# EasyEDA Pro project Esquemático e Layout - BitControl.eprj

# Schematic Schematic1
Board Name: Board1; Create Date: 2025-08-24; Page Name: P1; Project Name: New Project_Version_2; Schematic Name: Schematic1; Update Date: 2025-08-31; Company: EasyEDA.com; Page Size: A4; Version: V1.0
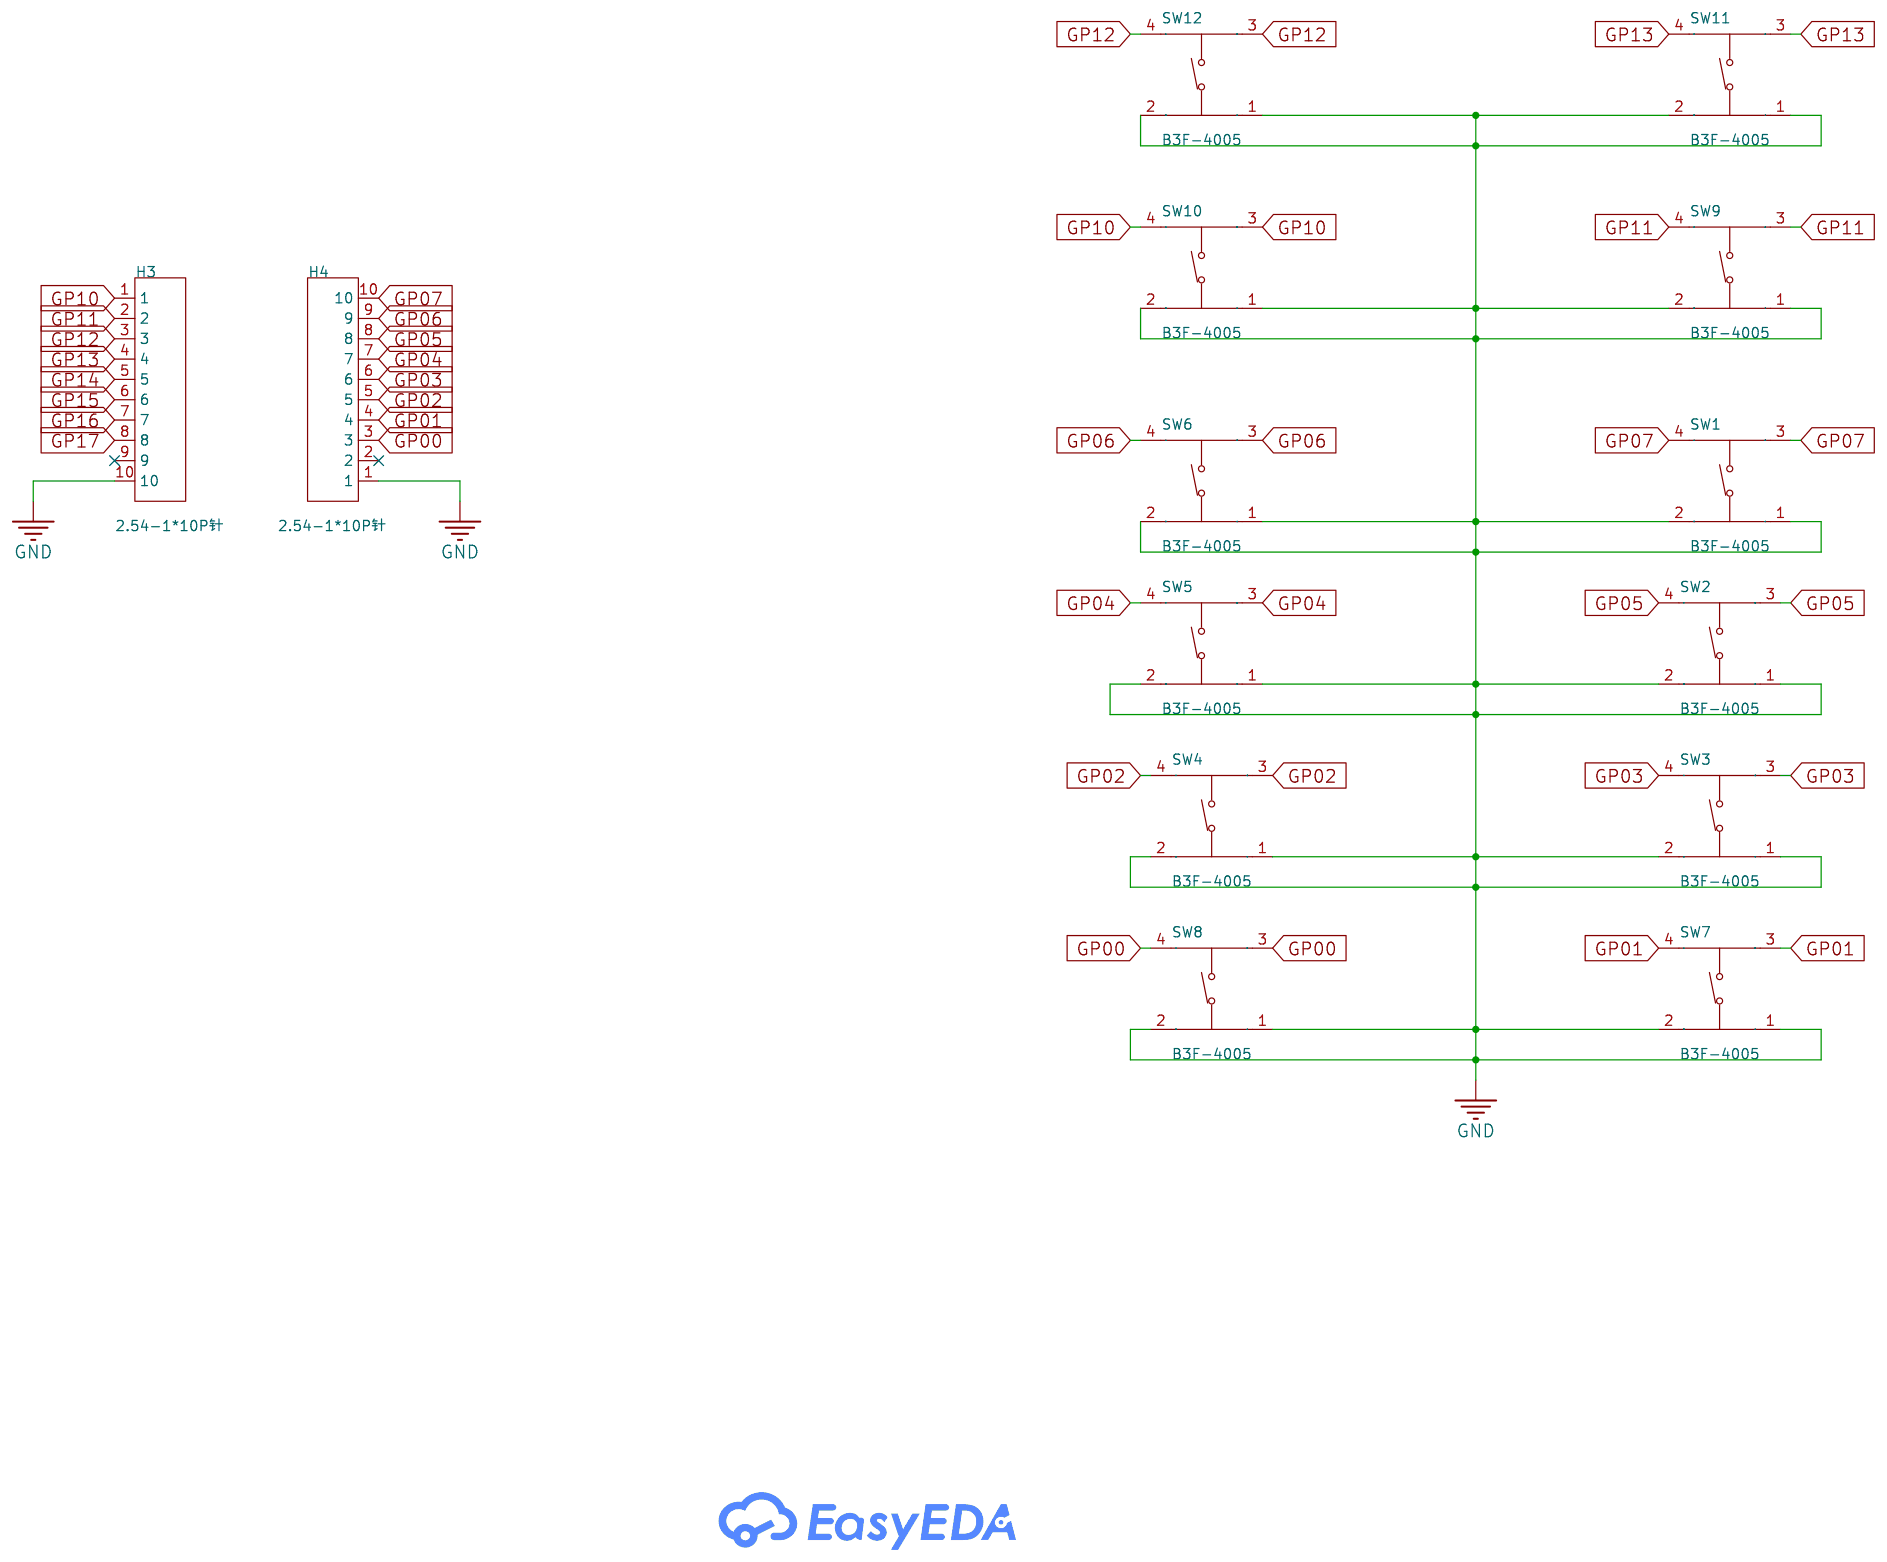
[diagram p0: schematic sheet]

## Parts
H3  2.54-1*10P针  [HDR-TH_10P-P2.54-V-M-1]
H4  2.54-1*10P针  [HDR-TH_10P-P2.54-V-M-1]
SW1  B3F-4005  [SW-TH_4P-L12.0-W12.0-P5.00-LS12.5-EH]
SW2  B3F-4005  [SW-TH_4P-L12.0-W12.0-P5.00-LS12.5-EH]
SW3  B3F-4005  [SW-TH_4P-L12.0-W12.0-P5.00-LS12.5-EH]
SW4  B3F-4005  [SW-TH_4P-L12.0-W12.0-P5.00-LS12.5-EH]
SW5  B3F-4005  [SW-TH_4P-L12.0-W12.0-P5.00-LS12.5-EH]
SW6  B3F-4005  [SW-TH_4P-L12.0-W12.0-P5.00-LS12.5-EH]
SW7  B3F-4005  [SW-TH_4P-L12.0-W12.0-P5.00-LS12.5-EH]
SW8  B3F-4005  [SW-TH_4P-L12.0-W12.0-P5.00-LS12.5-EH]
SW9  B3F-4005  [SW-TH_4P-L12.0-W12.0-P5.00-LS12.5-EH]
SW10  B3F-4005  [SW-TH_4P-L12.0-W12.0-P5.00-LS12.5-EH]
SW11  B3F-4005  [SW-TH_4P-L12.0-W12.0-P5.00-LS12.5-EH]
SW12  B3F-4005  [SW-TH_4P-L12.0-W12.0-P5.00-LS12.5-EH]

## Library data of the parts
H3 H4 = 2.54-1*10P针: Pin Structure:1x10P Pitch:2.54mm Row Spacing:- Circluar Pins/Square Pins:Policy Mounting Type:Straight Number of Rows:Single Row Number of Pins:10P Current Rating:3A Voltage Rating (Max):- Length of Mating Pin:- Insulation Height:- Length of End Connectio; LCSC Part Name: 1x10P 间距:2.54mm 方针 直插; Supplier Part: C57369; Manufacturer: BOOMELE(博穆精密); Supplier Footprint: 插件,P=2.54mm; JLCPCB Part Class: Extended Part; Datasheet: https://atta.szlcsc.com/upload/public/pdf/source/20151109/1457707572883.pdf; Supplier: LCSC; Pin Structure: 1x10P; Pitch: 2.54mm; Circluar Pins/Square Pins: Policy; Mounting Type: Straight; Number of Rows: Single Row; Number of Pins: 10P; Current Rating: 3A; Operating Temperature: -40℃~+105℃; Color: Black
SW1-SW12 = B3F-4005_C397283: Circuit:SPST Actuator Style:Round Button Mounting Style:Direct Insert Switch Length:12mm Switch Width:12mm Switch Height:4.3mm With Lamp:- Mechanical Life:-; LCSC Part Name: 12*12*4.3mm 直插 轻触开关; Supplier Part: C397283; Manufacturer: OMRON(欧姆龙); Supplier Footprint: 插件,12x12mm; JLCPCB Part Class: Extended Part; Datasheet: https://atta.szlcsc.com/upload/public/pdf/source/20191212/C469135_90BE0DB612FA51D178D2ECFD00DF8DE6.pdf; Supplier: LCSC; Circuit: SPST; Actuator Style: Round Button; Mounting Style: Direct Insert; Switch Length: 12mm; Switch Width: 12mm; Switch Height: 4.3mm

## Nets
GND: H3.10 H4.1 SW1.1 SW1.2 SW2.1 SW2.2 SW3.1 SW3.2 SW4.1 SW4.2 SW5.1 SW5.2 SW6.1 SW6.2 SW7.1 SW7.2 SW8.1 SW8.2 SW9.1 SW9.2 SW10.1 SW10.2 SW11.1 SW11.2 SW12.1 SW12.2
GP00: H4.3 SW8.3 SW8.4
GP01: H4.4 SW7.3 SW7.4
GP02: H4.5 SW4.3 SW4.4
GP03: H4.6 SW3.3 SW3.4
GP04: H4.7 SW5.3 SW5.4
GP05: H4.8 SW2.3 SW2.4
GP06: H4.9 SW6.3 SW6.4
GP07: H4.10 SW1.3 SW1.4
GP10: H3.1 SW10.3 SW10.4
GP11: H3.2 SW9.3 SW9.4
GP12: H3.3 SW12.3 SW12.4
GP13: H3.4 SW11.3 SW11.4
GP14: H3.5
GP15: H3.6
GP16: H3.7
GP17: H3.8

Not connected (* = marked no-connect by the designer): H3 9*; H4 2*

# Board PCB1
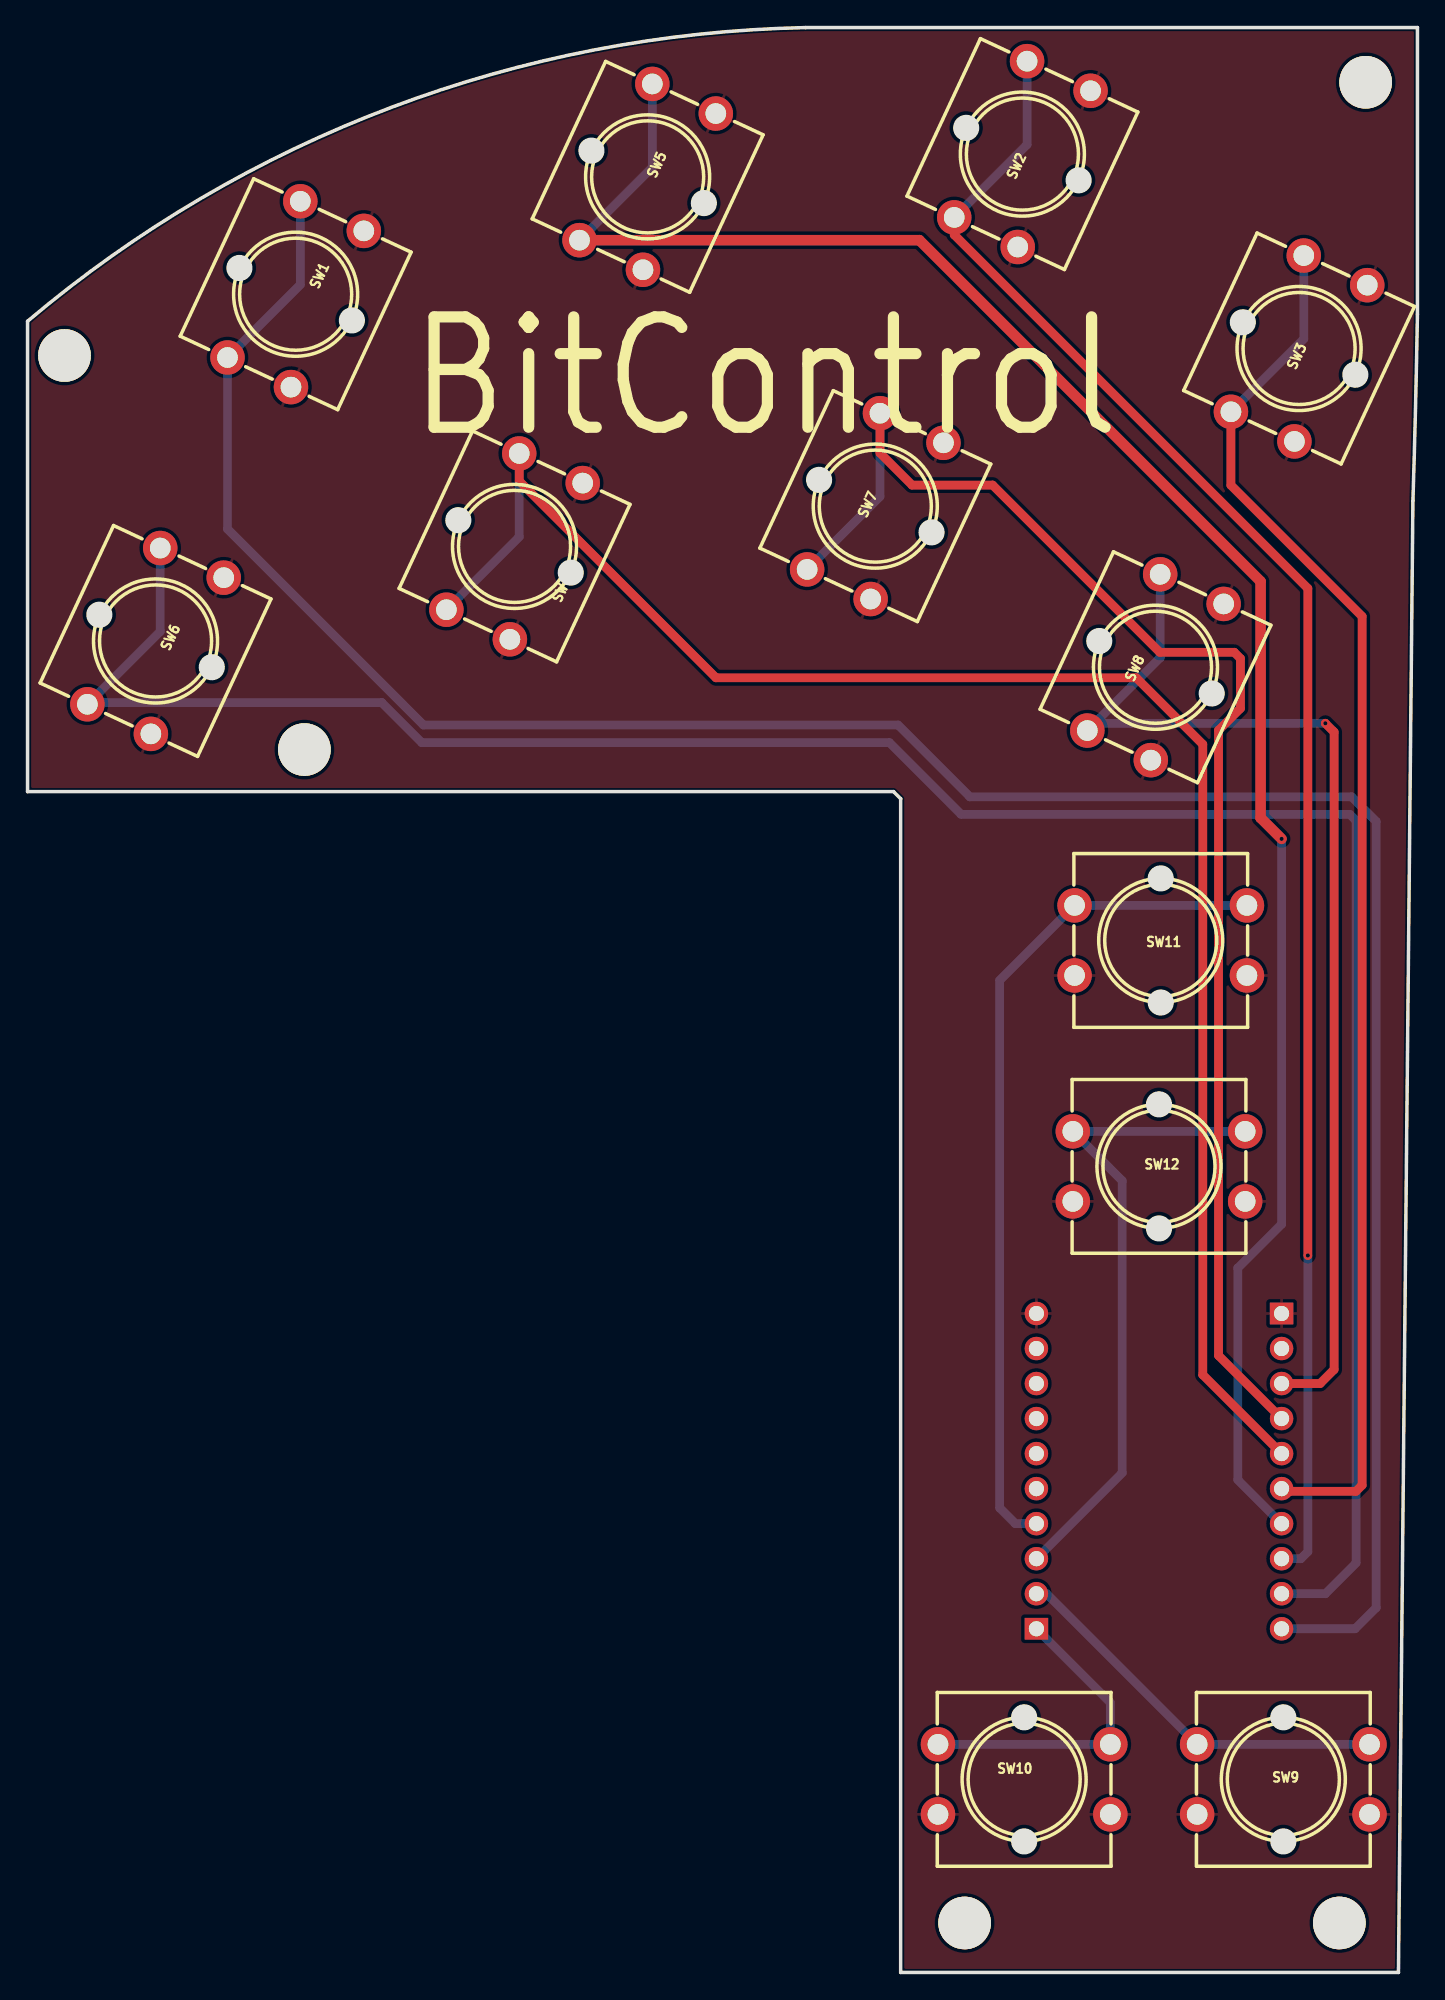
[diagram p1: board, top side]
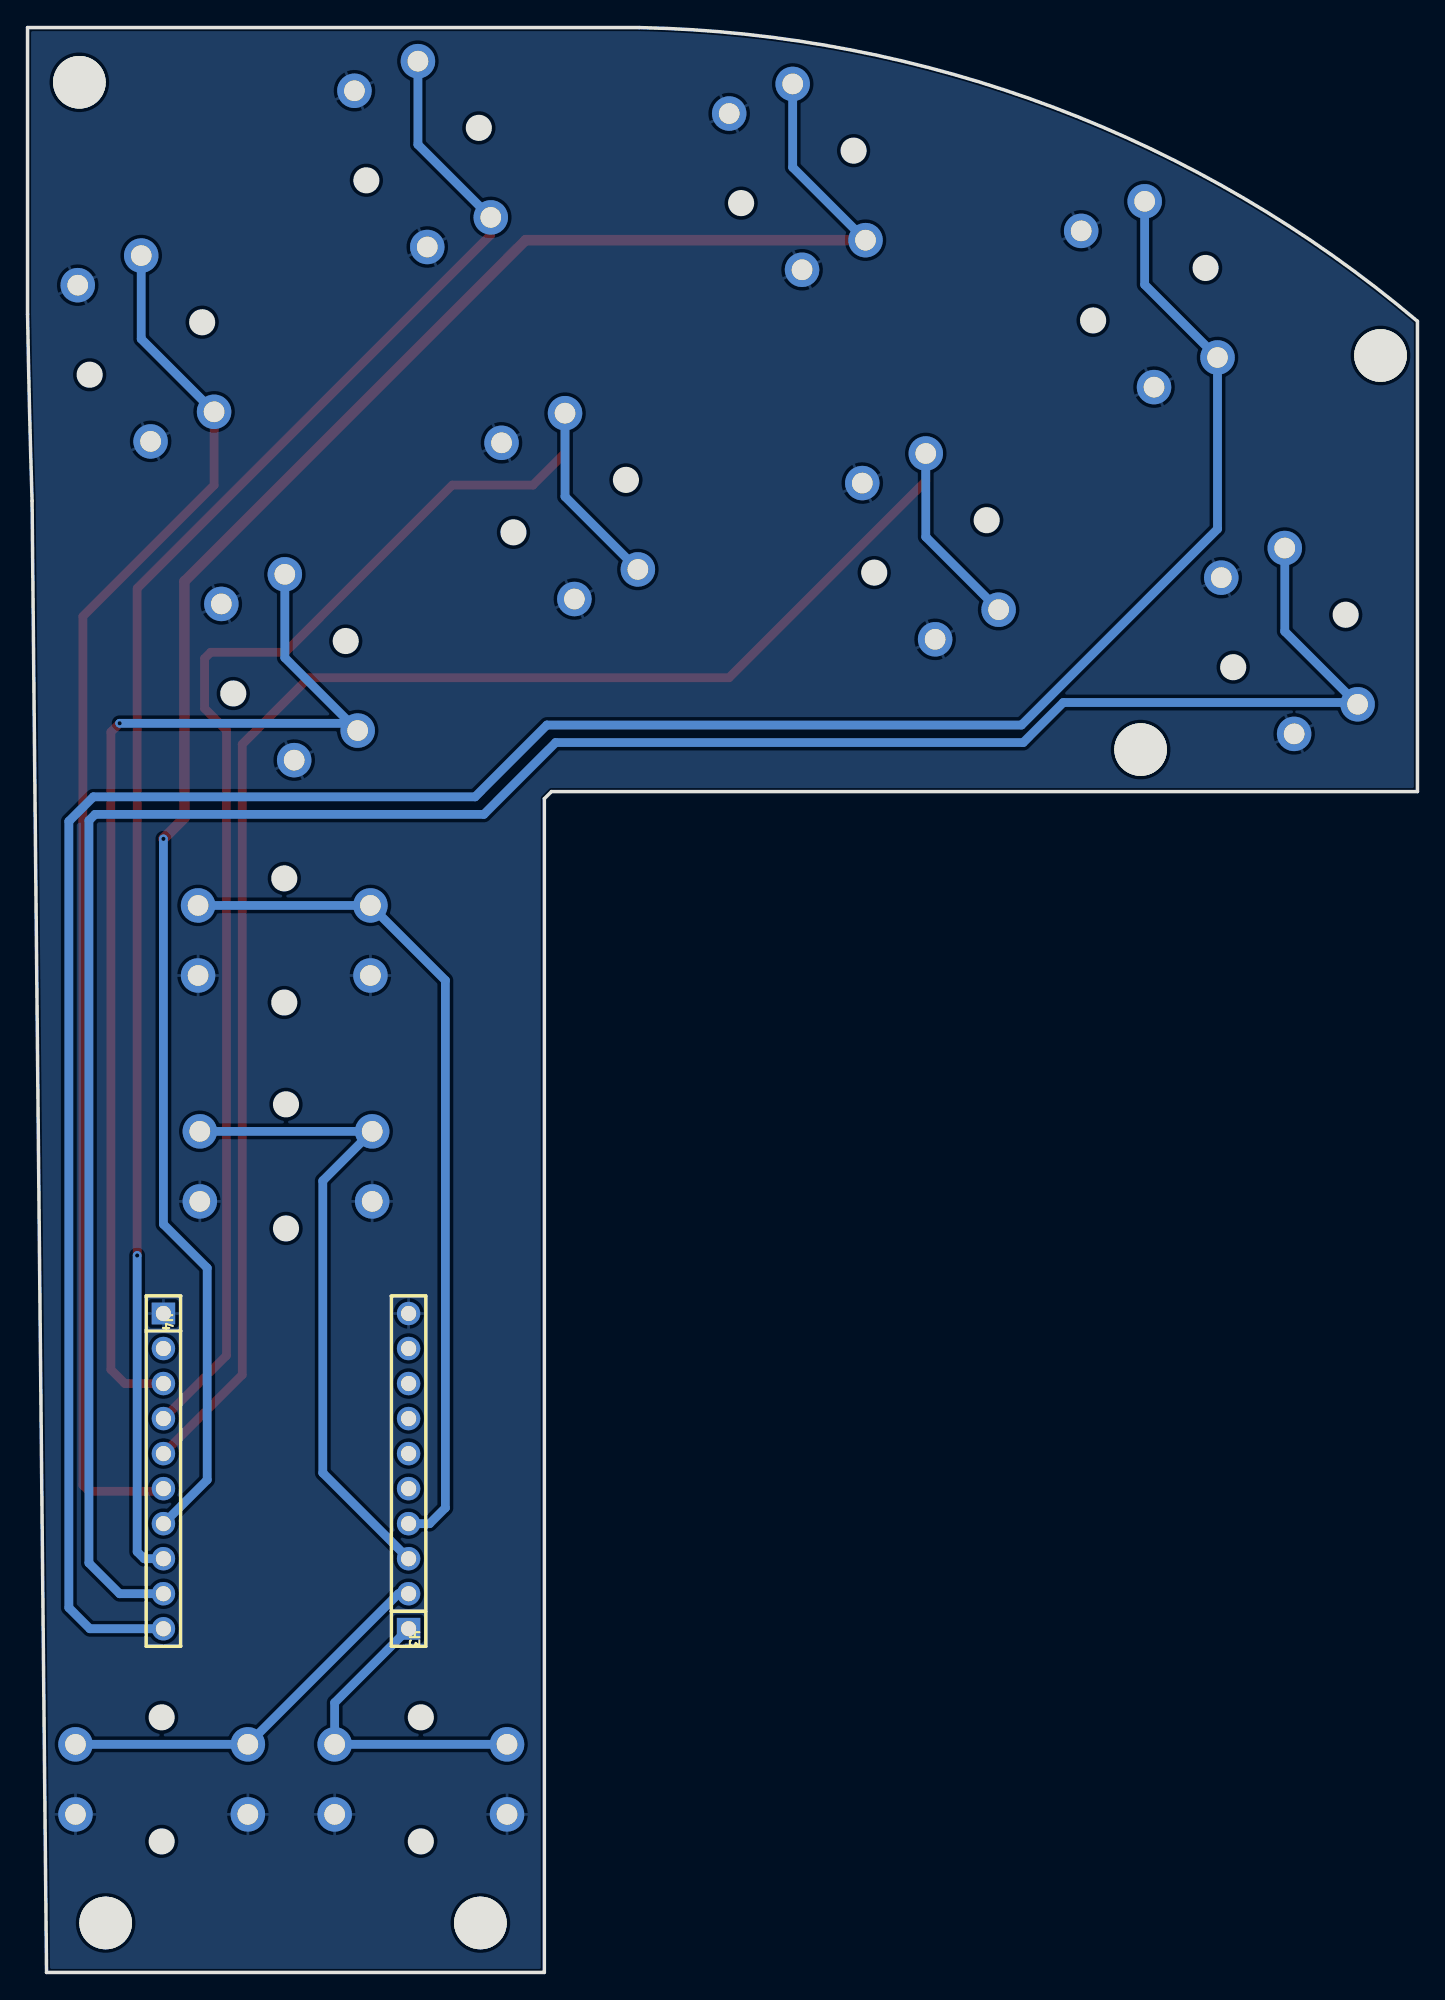
[diagram p2: board, bottom side, seen from below]

Outline 100.79 x 141.03 mm; copper layers: Top Layer, Bottom Layer. Coordinates in mm from the lower left corner of the outline.
Outline path: 0,119.74 arc(26.38,135.24) 56.43,141.03 100.79,141.03 100.79,120.24 arc(100.66,113.48) 100.47,106.71 99.42,0 63.32,0 63.32,85.11 62.8,85.63 0,85.63 0,119.74
Stack: Top Layer 0.035mm / Dielectric1 1.51mm FR4 er 4.5 / Bottom Layer 0.035mm

## Design rules (mm)
template: Custom Config
spacing copperThickness1oz (default): track to track 0.102, other pairs 0.152 to 0.3
spacing copperThickness2oz: track to track 0.203, other pairs 0.152 to 0.3
track width copperThickness1oz (default): min 0.127, default 0.254, max 2.54
track width copperThickness2oz: min 0.203, default 0.254, max 2.54
differential pair differentialPair (default): width min 0.127, default 0.254, max 2.54; gap min 0.152, default 0.152
via viaSize (default): diameter min 0.5, default 0.61, max 10; hole min 0.3, default 0.305, max 6.3

## Placement (name value [footprint] x y rotation side)
H3  2.54-1*10P针  [HDR-TH_10P-P2.54-V-M-1]  73.16 36.35 90 bottom
H4  2.54-1*10P针  [HDR-TH_10P-P2.54-V-M-1]  90.94 36.35 270 bottom
NOREF  -  [Pad_e45]  97.04 137.06 0 top
NOREF#2  -  [Pad_e46]  2.68 117.25 0 top
NOREF#3  -  [Pad_e1793]  20.08 88.68 0 top
NOREF#4  -  [Pad_e42]  67.96 3.59 0 top
NOREF#5  -  [Pad_e43]  95.13 3.59 0 top
SW1  B3F-4005  [SW-TH_4P-L12.0-W12.0-P5.00-LS12.5-EH]  19.44 121.7 65 top
SW2  B3F-4005  [SW-TH_4P-L12.0-W12.0-P5.00-LS12.5-EH]  72.15 131.86 65 top
SW3  B3F-4005  [SW-TH_4P-L12.0-W12.0-P5.00-LS12.5-EH]  92.21 117.76 65 top
SW4  B3F-4005  [SW-TH_4P-L12.0-W12.0-P5.00-LS12.5-EH]  35.32 103.41 65 top
SW5  B3F-4005  [SW-TH_4P-L12.0-W12.0-P5.00-LS12.5-EH]  44.97 130.2 65 top
SW6  B3F-4005  [SW-TH_4P-L12.0-W12.0-P5.00-LS12.5-EH]  9.28 96.55 65 top
SW7  B3F-4005  [SW-TH_4P-L12.0-W12.0-P5.00-LS12.5-EH]  61.48 106.33 65 top
SW8  B3F-4005  [SW-TH_4P-L12.0-W12.0-P5.00-LS12.5-EH]  81.8 94.64 65 top
SW9  B3F-4005  [SW-TH_4P-L12.0-W12.0-P5.00-LS12.5-EH]  91.07 14 0 top
SW10  B3F-4005  [SW-TH_4P-L12.0-W12.0-P5.00-LS12.5-EH]  72.27 14 0 top
SW11  B3F-4005  [SW-TH_4P-L12.0-W12.0-P5.00-LS12.5-EH]  82.18 74.83 0 top
SW12  B3F-4005  [SW-TH_4P-L12.0-W12.0-P5.00-LS12.5-EH]  82.05 58.45 0 top

## Footprints (pads in the part's own frame, mm; a bottom-side part is the same pattern mirrored in y, then rotated)
HDR-TH_10P-P2.54-V-M-1
  rect 1.575x1.7 hole 1.1: 1(-11.43,0)
  round 1.7 hole 1.1: 2(-8.89,0) 3(-6.35,0) 4(-3.81,0) 5(-1.27,0) 6(1.27,0) 7(3.81,0) 8(6.35,0) 9(8.89,0) 10(11.43,0)
Pad_e42
  round 3.81 hole 3.81: 1(0,0)
Pad_e43
  round 3.81 hole 3.81: 2(0,0)
Pad_e45
  round 3.81 hole 3.81: 2(0,0)
Pad_e46
  round 3.81 hole 3.81: 2(0,0)
Pad_e1793
  round 3.81 hole 3.81: 2(0,0)
SW-TH_4P-L12.0-W12.0-P5.00-LS12.5-EH
  round 2.5 hole 1.5: 1(6.25,-2.54) 2(-6.25,-2.54) 3(6.25,2.54) 4(-6.25,2.54)

## Nets
As in the schematic.

Pads without a net: H3 9; H4 2; NOREF 2; NOREF#2 2; NOREF#3 2; NOREF#4 1; NOREF#5 2

## Via types
v1: diameter 0.61, hole 0.305, Top Layer to Bottom Layer, 3 vias

## Routing (per net, layer and track width the routed paths; a pad name or vN(x,y) marks a point on that pad's centre or on a via; arc(x,y) is an arc through that point)
GP00: length 82
  Top Layer w0.635: v1(94.12,90.58) 94.75,89.95 94.75,43.72 93.74,42.7 H4.3
  Bottom Layer w0.635: v1(94.12,90.58) 77.73,90.58 77.23,90.07 ; SW8.4 82.14,95.34 82.14,101.38
GP01: length 106.4
  Top Layer w0.635: H4.4 86.37,44.73 86.37,90.07 87.96,91.66 87.96,95.28 87.51,95.73 82.11,95.73 69.99,107.85 64.15,107.85 61.82,110.18 61.82,113.07
  Bottom Layer w0.635: 61.82,113.07 61.82,107.02 SW7.4
GP02: length 126.8
  Top Layer w0.635: H4.5 85.23,43.34 85.23,89.06 80.4,93.88 49.92,93.88 35.66,108.15 SW4.3
  Bottom Layer w0.635: 30.37,98.82 35.66,104.1 SW4.3
GP03: length 101.4
  Top Layer w0.635: SW3.4 87.27,107.84 96.78,98.33 96.78,35.34 96.34,34.89 91.14,34.89 H4.6
  Bottom Layer w0.635: SW3.4 92.55,118.45 SW3.3
GP04: length 144.7
  Top Layer w0.762: v1(90.94,82.2) 89.42,83.72 89.42,100.87 64.67,125.61 SW5.4
  Bottom Layer w0.635: H4.7 87.77,35.72 87.77,51.08 90.94,54.26 v1(90.94,82.2) ; SW5.4 45.31,130.9 45.31,136.94
GP05: length 123
  Top Layer w0.635: 67.2,127.26 67.2,126 92.85,100.36 v1(92.85,51.99)
  Bottom Layer w0.635: v1(92.85,51.99) 92.85,30.51 92.34,30 H4.8 ; 67.2,127.26 72.49,132.55 SW2.3
GP06: length 169.1
  Bottom Layer w0.635: 4.47,92.09 9.62,97.24 SW6.3 ; 4.47,92.09 25.68,92.09 28.59,89.18 62.49,89.18 67.7,83.98 95.9,83.98 96.34,83.53 96.34,29.69 94.12,27.46 H4.9 ; 4.47,92.09 SW6.4
GP07: length 182.5
  Bottom Layer w0.635: H4.10 96.28,24.92 97.8,26.45 97.8,83.47 96.02,85.25 68.34,85.25 63.13,90.45 28.71,90.45 14.5,104.67 14.5,117.1 19.78,122.39 SW1.3
GP10: length 23.1
  Bottom Layer w0.635: SW10.4 SW10.3 78.52,19.56 H3.1
GP11: length 28.7
  Bottom Layer w0.635: SW9.3 SW9.4 73.9,27.46 H3.2
GP12: length 47.5
  Bottom Layer w0.635: SW12.3 SW12.4 79.39,57.41 79.39,36.22 H3.3
GP13: length 61.6
  Bottom Layer w0.635: SW11.3 SW11.4 70.5,71.94 70.5,33.68 71.64,32.54 H3.4

## Copper pours and planes (outline as drawn; the poured copper is in the pictures)
GND on Top Layer: -9.77,161.32 111.14,161.32 111.14,-10 -9.77,-10
GND on Bottom Layer: -12.31,150.14 108.34,150.14 108.34,-8.35 -12.31,-8.35

## Text on the board
Top Silkscreen Layer: BitControl
